# Altium schematic sheet Sheet2.SchDoc
size A; SheetNumber: 2; SheetTotal: 2
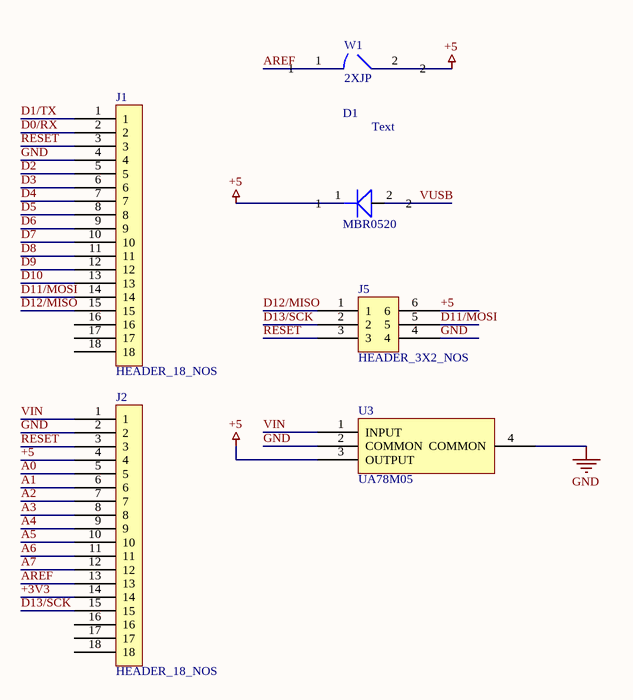
[diagram p0: Sheet2.SchDoc]

## Parts
D1  MBR0520  [shotkey diode sod962]
J1  HEADER_18_NOS  [DIP18]
J2  HEADER_18_NOS  [DIP18]
J5  HEADER_3X2_NOS  [DIP6]
U3  UA78M05  [SOT223-4]
W1  2XJP  [switch]

## Nets
+5: D1.1 J2.4 J5.6 U3.3(OUTPUT) W1.2
GND: J1.4 J2.2 J5.4 U3.2(COMMON) U3.4(COMMON)
+3V3: J2.14
A0: J2.5
A1: J2.6
A2: J2.7
A3: J2.8
A4: J2.9
A5: J2.10
A6: J2.11
A7: J2.12
AREF: J2.13 W1.1
D0/RX: J1.2
D1/TX: J1.1
D2: J1.5
D3: J1.6
D4: J1.7
D5: J1.8
D6: J1.9
D7: J1.10
D8: J1.11
D9: J1.12
D10: J1.13
D11/MOSI: J1.14 J5.5
D12/MISO: J1.15 J5.1
D13/SCK: J2.15 J5.2
RESET: J1.3 J2.3 J5.3
VIN: J2.1 U3.1(INPUT)
VUSB: D1.2

Not connected (* = marked no-connect by the designer): J1 16 17 18; J2 16 17 18

## Notes on the sheet
- (in symbol Component_1) Text

## Library data of the parts
D1 J1 J2 J5 U3 W1 = Component_1